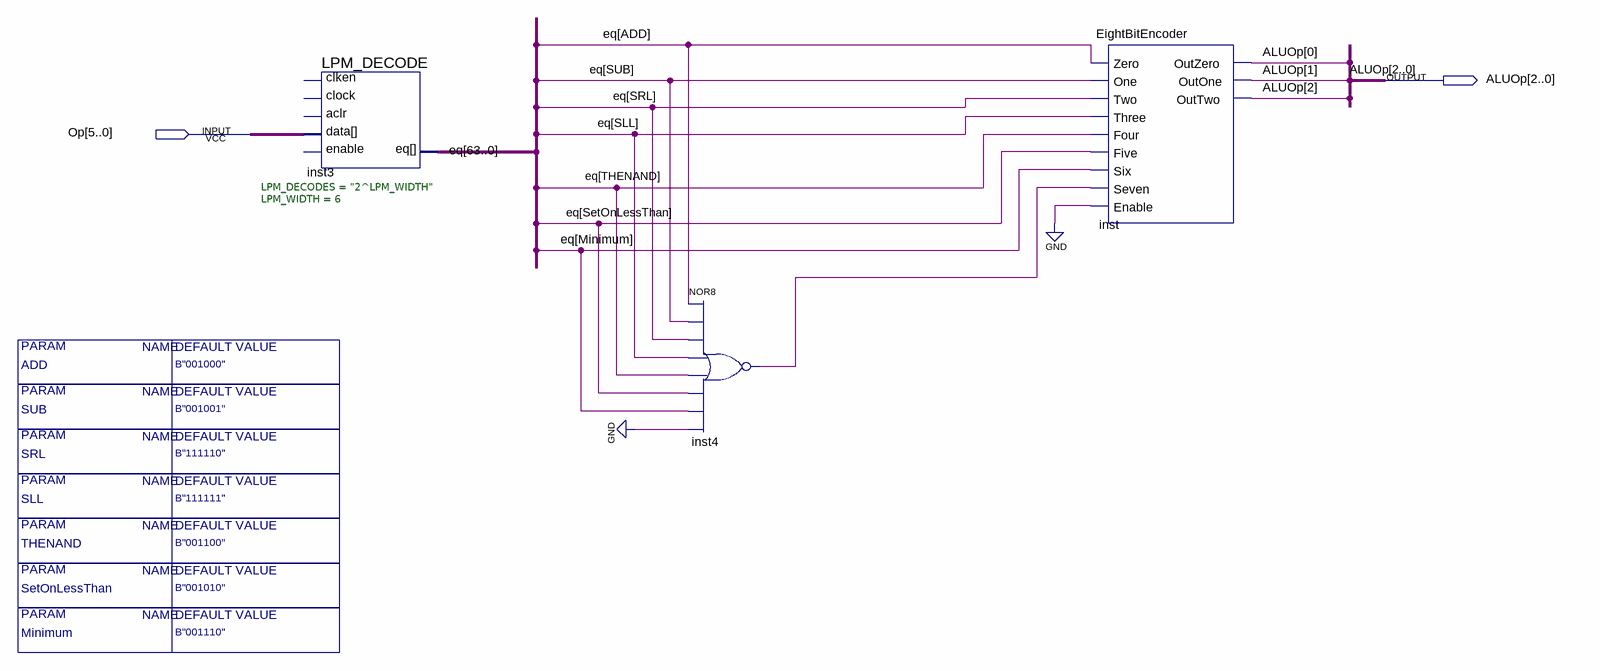
[diagram p0: schematic sheet]
// Quartus schematic OpToALUOp.bdf as structural Verilog: 3 symbols, 2 pins
module OpToALUOp #(parameter ADD = 'b001000, parameter SUB = 'b001001, parameter SRL = 'b111110, parameter SLL = 'b111111, parameter SetOnLessThan = 'b001010, parameter THENAND = 'b001100, parameter Minimum = 'b001110) (
  input  [5:0] Op,
  output [2:0] ALUOp
);

  wire \eq[ADD] , \eq[Minimum] , \eq[SetOnLessThan] , \eq[SLL] , \eq[SRL] , \eq[SUB] , \eq[THENAND] ,
       inst4_out;
  wire [63:0] eq;

  LPM_DECODE #(.LPM_DECODES("2^LPM_WIDTH"), .LPM_WIDTH(6)) inst3 (
    .data(Op), .eq(eq));  // open: enable, clken, clock, aclr
  nor inst4 (inst4_out, \eq[ADD] , \eq[SUB] , \eq[SRL] , \eq[SLL] , \eq[THENAND] , \eq[SetOnLessThan] , \eq[Minimum] , 1'b0);
  EightBitEncoder inst (
    .Zero(\eq[ADD] ), .One(\eq[SUB] ), .Two(\eq[SRL] ), .Three(\eq[SLL] ), .Four(\eq[THENAND] ),
    .Five(\eq[SetOnLessThan] ), .Six(\eq[Minimum] ), .Seven(inst4_out), .Enable(1'b0), .OutZero(ALUOp[0]),
    .OutOne(ALUOp[1]), .OutTwo(ALUOp[2]));
endmodule
